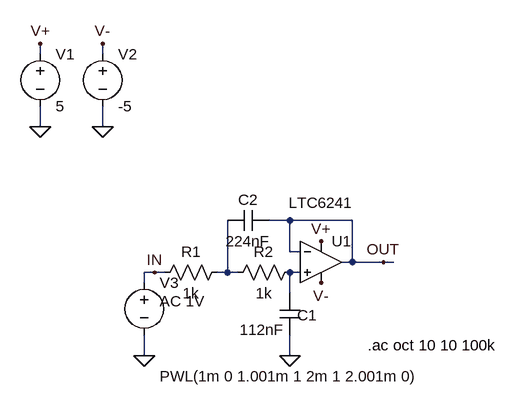
[diagram p0: schematic 2nd_order_butterworth_lp.asc]
2nd_order_butterworth_lp.asc, the LTspice schematic file:
Version 4
SHEET 1 1040 680
WIRE -640 -48 -640 -64
WIRE -544 -48 -544 -64
WIRE -640 64 -640 32
WIRE -544 64 -544 32
WIRE -256 208 -288 208
WIRE -160 208 -256 208
WIRE -256 256 -256 208
WIRE -240 256 -256 256
WIRE -160 272 -160 208
WIRE -160 272 -176 272
WIRE -112 272 -160 272
WIRE -96 272 -112 272
WIRE -464 288 -480 288
WIRE -448 288 -464 288
WIRE -352 288 -352 208
WIRE -352 288 -368 288
WIRE -336 288 -352 288
WIRE -240 288 -256 288
WIRE -480 304 -480 288
WIRE -256 320 -256 288
WIRE -480 416 -480 384
WIRE -256 416 -256 384
FLAG -640 64 0
FLAG -544 64 0
FLAG -208 304 V-
FLAG -544 -64 V-
FLAG -640 -64 V+
FLAG -208 240 V+
FLAG -256 416 0
FLAG -480 416 0
FLAG -464 288 IN
FLAG -112 272 OUT
SYMBOL voltage -640 -64 R0
SYMATTR InstName V1
SYMATTR Value 5
SYMBOL voltage -544 -64 R0
SYMATTR InstName V2
SYMATTR Value -5
SYMBOL LTC6241 -208 272 R0
WINDOW 3 -50 -91 Left 2
SYMATTR InstName U1
SYMBOL cap -240 384 R180
WINDOW 0 -26 30 Left 2
WINDOW 3 24 8 Left 2
SYMATTR InstName C1
SYMATTR Value 112nF
SYMBOL cap -288 192 R90
WINDOW 0 0 32 VBottom 2
WINDOW 3 32 32 VTop 2
SYMATTR InstName C2
SYMATTR Value 224nF
SYMBOL res -352 272 R90
WINDOW 0 0 56 VBottom 2
WINDOW 3 32 56 VTop 2
SYMATTR InstName R1
SYMATTR Value 1k
SYMBOL res -240 272 R90
WINDOW 0 0 56 VBottom 2
WINDOW 3 32 56 VTop 2
SYMATTR InstName R2
SYMATTR Value 1k
SYMBOL voltage -480 288 R0
WINDOW 3 24 160 Left 2
WINDOW 123 24 44 Left 2
WINDOW 39 0 0 Left 2
SYMATTR Value PWL(1m 0 1.001m 1 2m 1 2.001m 0)
SYMATTR Value2 AC 1V
SYMATTR InstName V3
TEXT -136 400 Left 2 !.ac oct 10 10 100k

The netlist it stands for:
* 2nd_order_butterworth_lp.asc
V1 V+ 0 5
V2 V- 0 -5
XU1 N002 OUT V+ V- OUT LTC6241  ; pins In+ In- V+ V- OUT
C1 0 N002 112nF
C2 OUT N001 224nF
R1 N001 IN 1k
R2 N002 N001 1k
V3 IN 0 PWL(1m 0 1.001m 1 2m 1 2.001m 0) AC 1V
.ac oct 10 10 100k
.lib LTC4.lib
.backanno
.end